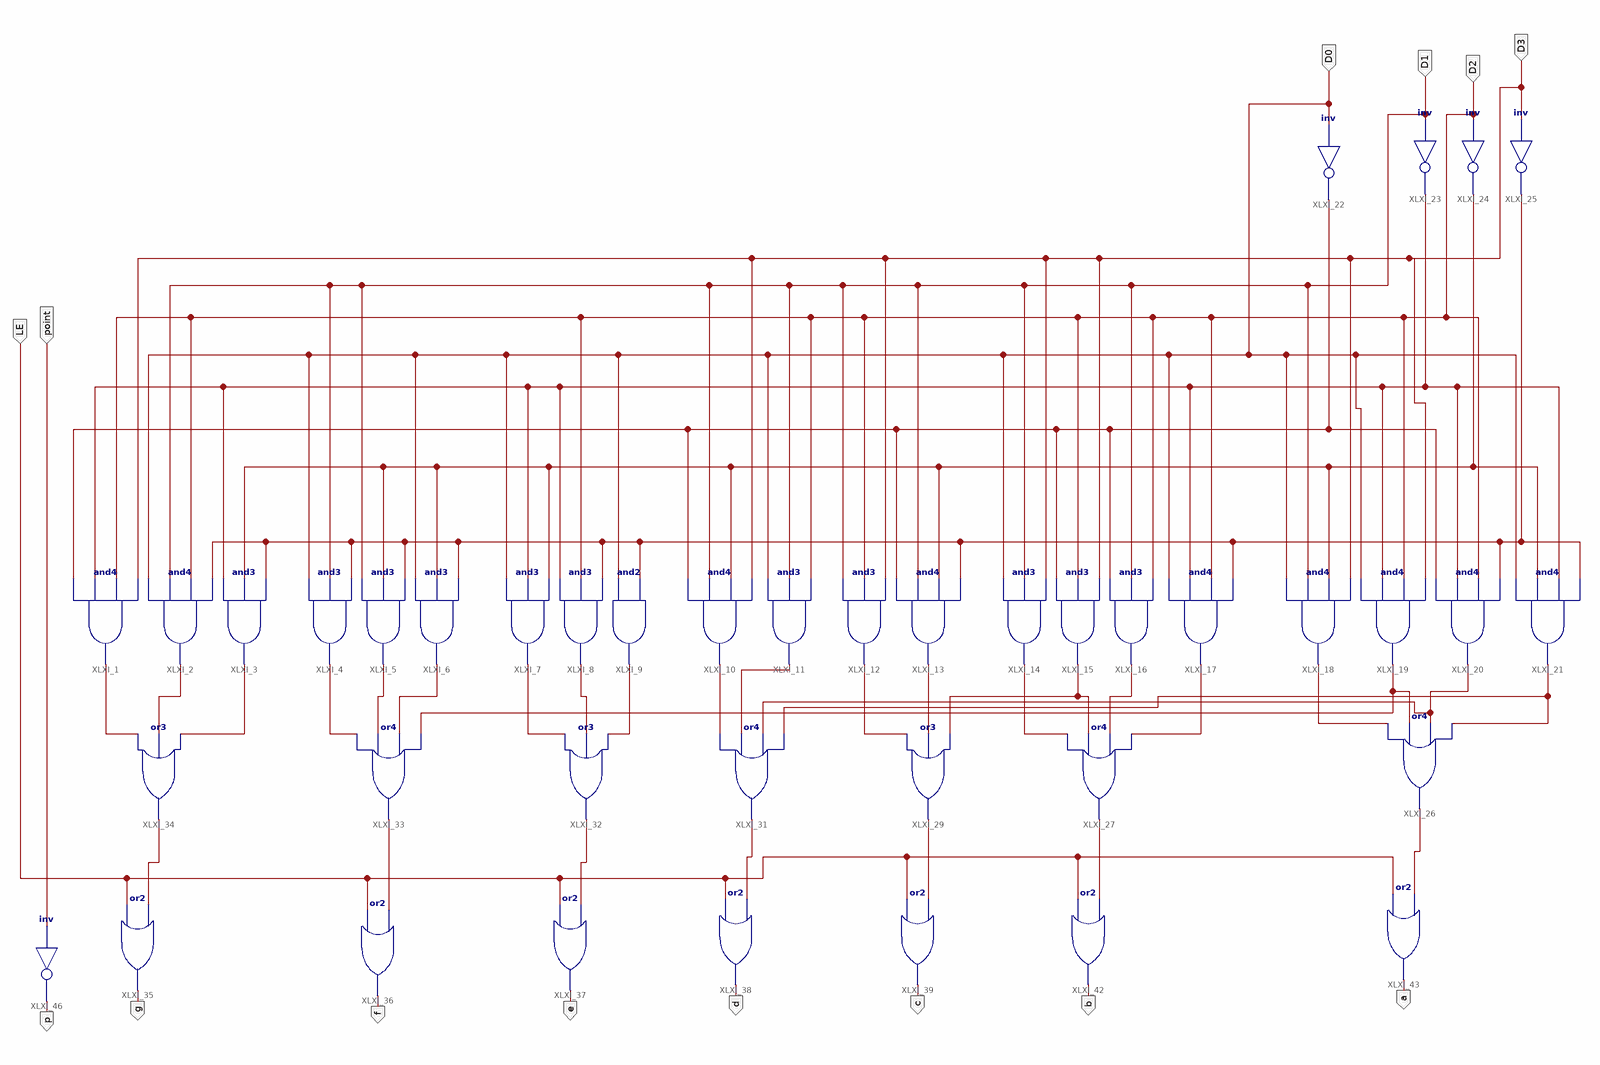
[diagram p0: schematic sheet 1]
// Xilinx ISE schematic MyMC14495.sch (kintex7) as structural Verilog: 40 symbols, 14 ports
module MyMC14495 (
  input  D0,
  input  D2,
  input  D3,
  input  D1,
  input  LE,
  input  point,
  output p,
  output g,
  output f,
  output e,
  output d,
  output c,
  output b,
  output a
);

  wire XLXN_1, XLXN_5, XLXN_6, XLXN_8, XLXN_32, XLXN_33, XLXN_34, XLXN_35, XLXN_36, XLXN_37, XLXN_39,
       XLXN_40, XLXN_41, XLXN_42, XLXN_43, XLXN_44, XLXN_45, XLXN_46, XLXN_49, XLXN_50, XLXN_51, XLXN_52,
       XLXN_53, XLXN_57, XLXN_58, XLXN_59, XLXN_60, XLXN_61, XLXN_62, XLXN_63, XLXN_64, XLXN_65;

  and XLXI_1 (XLXN_32, XLXN_1, XLXN_5, D2, D3);
  and XLXI_2 (XLXN_33, D0, D1, D2, XLXN_8);
  and XLXI_3 (XLXN_34, XLXN_5, XLXN_6, XLXN_8);
  and XLXI_4 (XLXN_35, D0, D1, XLXN_8);
  and XLXI_5 (XLXN_36, D1, XLXN_6, XLXN_8);
  and XLXI_6 (XLXN_37, D0, XLXN_6, XLXN_8);
  and XLXI_7 (XLXN_39, D0, XLXN_5, XLXN_6);
  and XLXI_8 (XLXN_40, XLXN_5, D2, XLXN_8);
  and XLXI_9 (XLXN_41, D0, XLXN_8);
  and XLXI_10 (XLXN_42, XLXN_1, D1, XLXN_6, D3);
  and XLXI_11 (XLXN_43, D0, D1, D2);
  and XLXI_12 (XLXN_44, D1, D2, D3);
  and XLXI_13 (XLXN_45, XLXN_1, D1, XLXN_6, XLXN_8);
  and XLXI_14 (XLXN_46, D0, D1, D3);
  and XLXI_15 (XLXN_51, XLXN_1, D2, D3);
  and XLXI_16 (XLXN_49, XLXN_1, D1, D2);
  and XLXI_17 (XLXN_50, D0, XLXN_5, D2, XLXN_8);
  and XLXI_18 (XLXN_52, D0, D1, XLXN_6, D3);
  and XLXI_19 (XLXN_53, D0, XLXN_5, D2, D3);
  and XLXI_20 (XLXN_58, XLXN_1, XLXN_5, D2, XLXN_8);
  and XLXI_21 (XLXN_57, D0, XLXN_6, XLXN_5, XLXN_8);
  not XLXI_22 (XLXN_1, D0);
  not XLXI_23 (XLXN_5, D1);
  not XLXI_24 (XLXN_6, D2);
  not XLXI_25 (XLXN_8, D3);
  or XLXI_26 (XLXN_65, XLXN_52, XLXN_53, XLXN_58, XLXN_57);
  or XLXI_27 (XLXN_64, XLXN_46, XLXN_51, XLXN_49, XLXN_50);
  or XLXI_29 (XLXN_63, XLXN_44, XLXN_45, XLXN_51);
  or XLXI_31 (XLXN_62, XLXN_42, XLXN_43, XLXN_58, XLXN_57);
  or XLXI_32 (XLXN_61, XLXN_39, XLXN_40, XLXN_41);
  or XLXI_33 (XLXN_60, XLXN_35, XLXN_36, XLXN_37, XLXN_53);
  or XLXI_34 (XLXN_59, XLXN_32, XLXN_33, XLXN_34);
  or XLXI_35 (g, LE, XLXN_59);
  or XLXI_36 (f, LE, XLXN_60);
  or XLXI_37 (e, LE, XLXN_61);
  or XLXI_38 (d, LE, XLXN_62);
  or XLXI_39 (c, LE, XLXN_63);
  or XLXI_42 (b, LE, XLXN_64);
  or XLXI_43 (a, LE, XLXN_65);
  not XLXI_46 (p, point);
endmodule
